# Altium project Serializer_Board.PrjPcb (part 2 of 2)

## Sheet FTDI_USB_To_UART.SchDoc
size A3; SheetNumber: 6; SheetTotal: 7
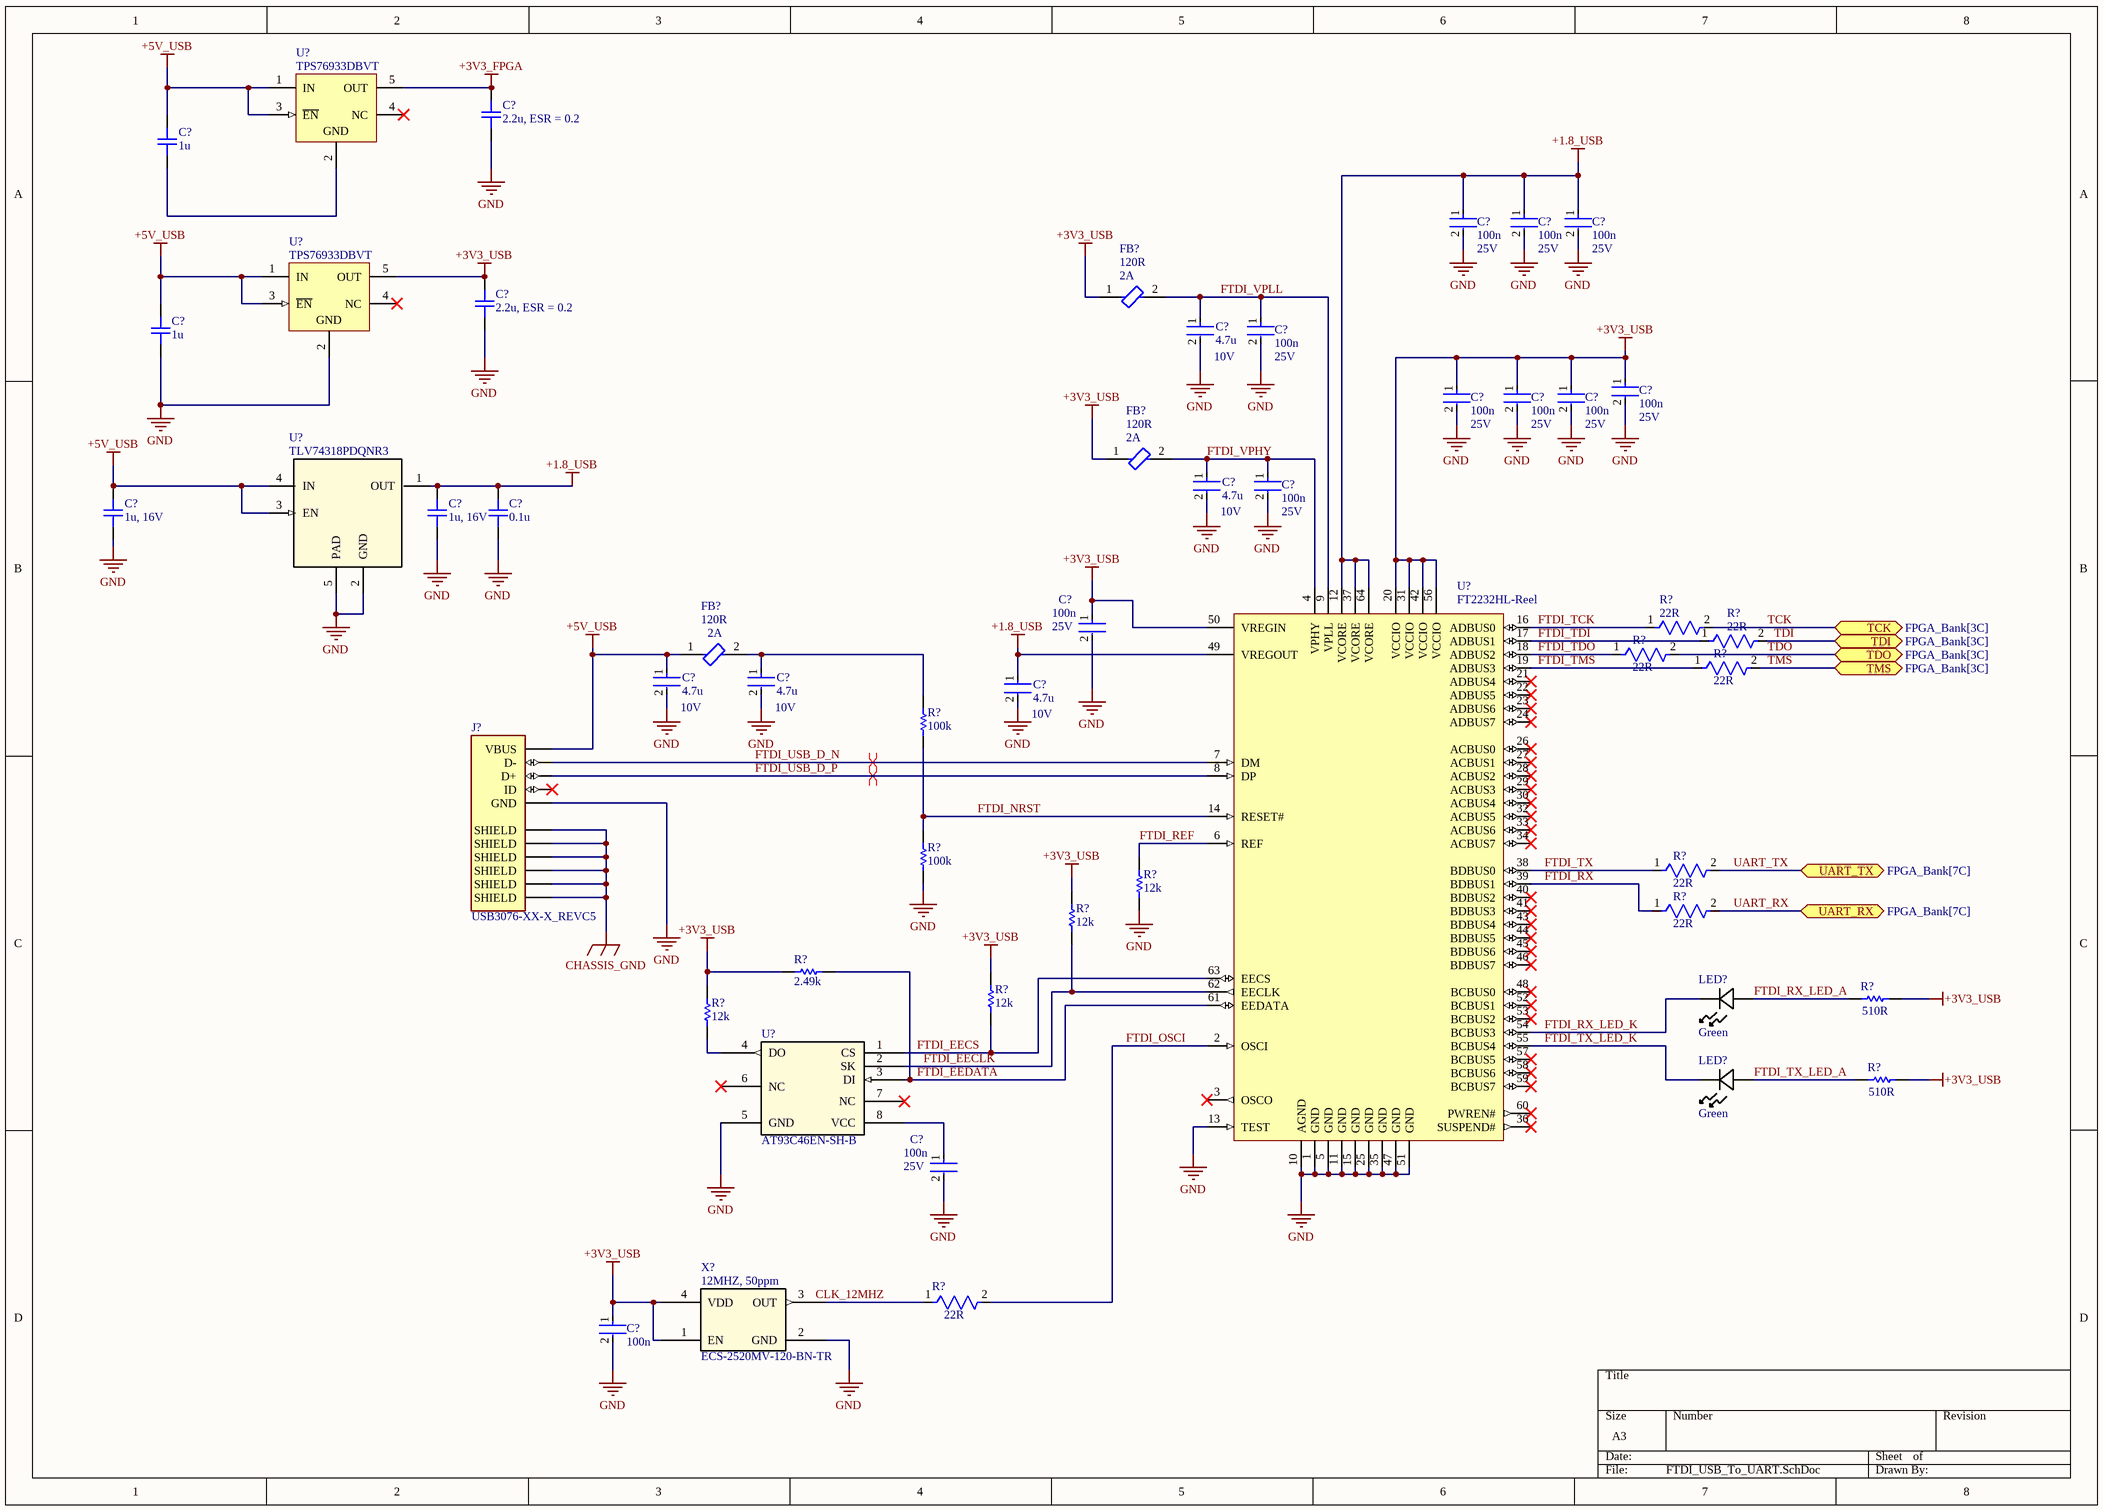
[diagram p3: FTDI_USB_To_UART.SchDoc]

### Parts
(Parts that share a designator on the sheet are numbered #1, #2 ... from top to bottom, then left to right.)
C?#42  2.2u, ESR = 0.2  [CAP_0603]
C?#43  1u  [CAP_0402]
C?#44  100n  [FP-CL278-IPC_C]
C?#45  100n  [FP-CL278-IPC_C]
C?#46  100n  [FP-CL278-IPC_C]
C?#47  2.2u, ESR = 0.2  [CAP_0603]
C?#48  4.7u  [FP-CL282-IPC_C]
C?#49  100n  [FP-CL278-IPC_C]
C?#50  1u  [CAP_0402]
C?#51  100n  [FP-CL278-IPC_C]
C?#52  100n  [FP-CL278-IPC_C]
C?#53  100n  [FP-CL278-IPC_C]
C?#54  100n  [FP-CL278-IPC_C]
C?#55  4.7u  [FP-CL282-IPC_C]
C?#56  100n  [FP-CL278-IPC_C]
C?#57  1u, 16V  [CAP_0402]
C?#58  1u, 16V  [CAP_0402]
C?#59  0.1u  [CAP_0402]
C?#60  100n  [FP-CL278-IPC_C]
C?#61  4.7u  [FP-CL282-IPC_C]
C?#62  4.7u  [FP-CL282-IPC_C]
C?#63  4.7u  [FP-CL282-IPC_C]
C?#64  100n  [FP-CL278-IPC_C]
C?#65  100n  [FP-CL278-IPC_C]
FB?#5  120R  [FP-BLM15-0_05-d0_7-MFG]
FB?#6  120R  [FP-BLM15-0_05-d0_7-MFG]
FB?#7  120R  [FP-BLM15-0_05-d0_7-MFG]
J?#3  USB3076-XX-X_REVC5  [GCT_USB3076-XX-X_REVC5]
LED?#1  Green  [LED_LTW-C193TS5_LTO]
LED?#2  Green  [LED_LTW-C193TS5_LTO]
R?#39  22R  [FP-RC0402-0_4-MFG]
R?#40  22R  [FP-RC0402-0_4-MFG]
R?#41  22R  [FP-RC0402-0_4-MFG]
R?#42  22R  [FP-RC0402-0_4-MFG]
R?#43  100k  [RESC1005X40X25NL05T10]
R?#44  100k  [RESC1005X40X25NL05T10]
R?#45  22R  [FP-RC0402-0_4-MFG]
R?#46  12k  [RESC1005X40X25NL05T10]
R?#47  22R  [FP-RC0402-0_4-MFG]
R?#48  12k  [RESC1005X40X25NL05T10]
R?#49  2.49k  [RESC1005X40X25NL05T10]
R?#50  510R  [RESC1005X40X25LL05T05]
R?#51  12k  [RESC1005X40X25NL05T10]
R?#52  12k  [RESC1005X40X25NL05T10]
R?#53  510R  [RESC1005X40X25LL05T05]
R?#54  22R  [FP-RC0402-0_4-MFG]
U?#3  TPS76933DBVT  [DBV0005A_N]
U?#4  TPS76933DBVT  [DBV0005A_N]
U?#5  TLV74318PDQNR3  [DQN0004A]
U?#6  FT2232HL-Reel  [LQFP-64_M]
U?#7  AT93C46EN-SH-B  [8S1_ATM]
X?  ECS-2520MV-120-BN-TR  [SMD4_ECS-2520MV_ECS]

### Ports
TCK (bidir, see FPGA_Bank[3C]), TDI (bidir, see FPGA_Bank[3C]), TDO (bidir, see FPGA_Bank[3C]), TMS (bidir, see FPGA_Bank[3C]), UART_RX (bidir, see FPGA_Bank[7C]), UART_TX (bidir, see FPGA_Bank[7C])

### Nets
+1.8_USB: C?#44.1 C?#45.1 C?#46.1 C?#58.2 C?#59.2 C?#63.1 U?#5.1(OUT) U?#6.12(VCORE) U?#6.37(VCORE) U?#6.49(VREGOUT) U?#6.64(VCORE)
+3V3_FPGA: C?#42.2 U?#3.5(OUT)
+3V3_USB: C?#47.2 C?#51.1 C?#52.1 C?#53.1 C?#54.1 C?#60.1 C?#65.1 FB?#5.1 FB?#6.1 R?#48.2 R?#49.1 R?#50.2 R?#51.2 R?#52.2 R?#53.2 U?#4.5(OUT) U?#6.20(VCCIO) U?#6.31(VCCIO) U?#6.42(VCCIO) U?#6.50(VREGIN) U?#6.56(VCCIO) X?.1(EN) X?.4(VDD)
+5V_USB: C?#43.2 C?#50.2 C?#57.2 C?#61.1 FB?#7.1 J?#3.1(VBUS) U?#3.1(IN) U?#3.3(~{EN}) U?#4.1(IN) U?#4.3(~{EN}) U?#5.3(EN) U?#5.4(IN)
CHASSIS_GND: J?#3.6(SHIELD) J?#3.7(SHIELD) J?#3.8(SHIELD) J?#3.9(SHIELD) J?#3.10(SHIELD) J?#3.11(SHIELD)
GND: C?#42.1 C?#44.2 C?#45.2 C?#46.2 C?#47.1 C?#48.2 C?#49.2 C?#50.1 C?#51.2 C?#52.2 C?#53.2 C?#54.2 C?#55.2 C?#56.2 C?#57.1 C?#58.1 C?#59.1 C?#60.2 C?#61.2 C?#62.2 C?#63.2 C?#64.2 C?#65.2 J?#3.5(GND) R?#44.1 R?#46.1 U?#4.2(GND) U?#5.2(GND) U?#5.5(PAD) U?#6.1(GND) U?#6.5(GND) U?#6.10(AGND) U?#6.11(GND) U?#6.13(TEST) U?#6.15(GND) U?#6.25(GND) U?#6.35(GND) U?#6.47(GND) U?#6.51(GND) U?#7.5(GND) X?.2(GND)
FTDI_EECLK: R?#48.1 U?#6.62(EECLK) U?#7.2(SK)  [project net FTDI_EECLK_6]
FTDI_EECS: R?#51.1 U?#6.63(EECS) U?#7.1(CS)  [project net FTDI_EECS_6]
FTDI_EEDATA: R?#49.2 U?#6.61(EEDATA) U?#7.3(DI)  [project net FTDI_EEDATA_6]
FTDI_NRST: R?#43.1 R?#44.2 U?#6.14(RESET#)  [project net FTDI_NRST_6]
FTDI_OSCI: R?#54.2 U?#6.2(OSCI)  [project net FTDI_OSCI_6]
FTDI_REF: R?#46.2 U?#6.6(REF)  [project net FTDI_REF_6]
FTDI_RX: R?#47.1 U?#6.39(BDBUS1)  [project net FTDI_RX_6]
FTDI_RX_LED_A: LED?#1.2 R?#50.1  [project net FTDI_RX_LED_A_6]
FTDI_RX_LED_K: LED?#1.1 U?#6.54(BCBUS3)  [project net FTDI_RX_LED_K_6]
FTDI_TCK: R?#39.1 U?#6.16(ADBUS0)  [project net FTDI_TCK_6]
FTDI_TDI: R?#40.1 U?#6.17(ADBUS1)  [project net FTDI_TDI_6]
FTDI_TDO: R?#41.1 U?#6.18(ADBUS2)  [project net FTDI_TDO_6]
FTDI_TMS: R?#42.1 U?#6.19(ADBUS3)  [project net FTDI_TMS_6]
FTDI_TX: R?#45.1 U?#6.38(BDBUS0)  [project net FTDI_TX_6]
FTDI_TX_LED_A: LED?#2.2 R?#53.1  [project net FTDI_TX_LED_A_6]
FTDI_TX_LED_K: LED?#2.1 U?#6.55(BCBUS4)  [project net FTDI_TX_LED_K_6]
FTDI_USB_D_N: J?#3.2(D-) U?#6.7(DM)  [project net FTDI_USB_D_N_6]
FTDI_USB_D_P: J?#3.3(D+) U?#6.8(DP)  [project net FTDI_USB_D_P_6]
FTDI_VPHY: C?#55.1 C?#56.1 FB?#6.2 U?#6.4(VPHY)  [project net FTDI_VPHY_6]
FTDI_VPLL: C?#48.1 C?#49.1 FB?#5.2 U?#6.9(VPLL)  [project net FTDI_VPLL_6]
TCK: R?#39.2 ; port TCK
TDI: R?#40.2 ; port TDI
TDO: R?#41.2 ; port TDO
TMS: R?#42.2 ; port TMS
UART_RX: R?#47.2 ; port UART_RX
UART_TX: R?#45.2 ; port UART_TX
NetC?#43_1: C?#43.1 U?#3.2(GND)
NetC?#62_1: C?#62.1 FB?#7.2 R?#43.2
NetC?#64_1: C?#64.1 U?#7.8(VCC)
NetR?#52_1: R?#52.1 U?#7.4(DO)
NetR?#54_1: R?#54.1 X?.3(OUT)

Not connected (* = marked no-connect by the designer): J?#3 4(ID)*; U?#3 4(NC)*; U?#4 4(NC)*; U?#6 3(OSCO)* 21(ADBUS4)* 22(ADBUS5)* 23(ADBUS6)* 24(ADBUS7)* 26(ACBUS0)* 27(ACBUS1)* 28(ACBUS2)* 29(ACBUS3)* 30(ACBUS4)* 32(ACBUS5)* 33(ACBUS6)* 34(ACBUS7)* 36(SUSPEND#)* 40(BDBUS2)* 41(BDBUS3)* 43(BDBUS4)* 44(BDBUS5)* 45(BDBUS6)* 46(BDBUS7)* 48(BCBUS0)* 52(BCBUS1)* 53(BCBUS2)* 57(BCBUS5)* 58(BCBUS6)* 59(BCBUS7)* 60(PWREN#)*; U?#7 6(NC)* 7(NC)*

### Layout directives
differential pair: FTDI_USB_D_N_6, FTDI_USB_D_P_6

### Notes on the sheet
- (near FB?#5) 2A
- (near C?#44) 25V
- (near C?#45) 25V
- (near C?#46) 25V
- (near C?#48) 10V
- (near C?#49) 25V
- (near FB?#6) 2A
- (near C?#52) 25V
- (near C?#53) 25V
- (near C?#54) 25V
- (near C?#51) 25V
- (near C?#55) 10V
- (near C?#56) 25V
- (near FB?#7) 2A
- (near C?#60) 25V
- (near C?#61) 10V
- (near C?#62) 10V
- (near C?#63) 10V
- (near C?#64) 25V
- (near X?) 12MHZ, 50ppm
- Labels drawn without touching a wire or pin: CLK_12MHZ

### Library data of the parts
C?#42 C?#47 = CAP_0603: Capacitor SMD 0603; Manufacturer: *; Manufacturer Part Number: *; Distributor Link: *; LCSC: *; Rating: *; Dielectric: *
C?#43 C?#50 C?#57-C?#59 = CAP_0402: Capacitor SMD 0402; Manufacturer: *; Manufacturer Part Number: *; Distributor Link: *; LCSC: *; Rating: *; Dielectric: *
C?#44-C?#46 C?#49 C?#51-C?#54 C?#56 C?#60 C?#64 C?#65 = CMP-13271-000728-1: Cap Ceramic 100nF 25V X5R ±10% SMD 0402 +85°C Paper T/R; Package Quantity: 1; Height: 0.5mm; Case Code (Metric): 1005; Thickness: 0.022inch; Mount: Surface Mount; Lead Free: Lead Free; Case Code (Imperial): 0402; Packaging: Tape and Reel; Depth: 0.5mm; Voltage: 25V; Min Operating Temperature: -55°C; Voltage Rating: 25V; Dielectric: X5R; Case/Package: 0402; Tolerance: 10%; Width: 0.02inch; Max Operating Temperature: 85°C; Capacitance: 100nF; Length: 1mm; Radiation Hardening: No; Voltage Rating (DC): 25V
C?#48 C?#55 C?#61-C?#63 = CMP-13271-000548-1: Cap Ceramic 4.7uF 10V X5R ±20% SMD 0402 +85°C Paper T/R; Capacitance: 4.7uF; Max Operating Temperature: 85°C; Lead Free: Lead Free; Tolerance: 20%; Voltage Rating: 10V; Dielectric: X5R; Width: 0.02inch; Length: 0.039inch; Case/Package: 0402; Min Operating Temperature: -55°C; Packaging: Tape and Reel; Thickness: 0.022inch; Case Code (Imperial): 0402; Package Quantity: 10000; Case Code (Metric): 1005; Mount: Surface Mount
FB?#5-FB?#7 = CMP-0686-00133-3: Chip Ferrite Bead, 0402, 120Ω @ 100MHz, 0.055Ω, 25%, 2A; DC Resistance (DCR): 55mR; Number of Circuits: 1; Material: Steel; Lead Free: Lead Free; Package Quantity: 10000; Impedance: 120R; Width: 0.5mm; Case Code (Metric): 1005; Test Frequency: 100MHz; Weight: 2.3E-05oz; Max DC Current: 2A; Current Rating: 2A; REACH SVHC: No SVHC; Case Code (Imperial): 0402; Min Operating Temperature: -55°C; Max Operating Temperature: 125°C; Max Current Rating: 2A; Series: EMIFIL®, BLM15P; Tolerance: 25%; Termination: SMD/SMT; Number of Lines: 1; Case/Package: 0402; RoHS Compliant: Yes; Number of Pins: 2; Length: 1mm; Height: 0.5mm; Packaging: Tape and Reel
J?#3 = USB3076-XX-X_REVC5: USB - micro B USB 2.0 Receptacle Connector 5 Position Surface Mount, Right Angle; Through Hole, 2.35mm profile, 5 Pins, Horizontal, Bottom mount; MP: USB3076-30-A; MF: Global Connector Technology; SnapEDA_Link: https://www.snapeda.com/parts/USB3076-30-A/Global+Connector+Technology/view-part/?ref=snap; Package: None; Check_prices: https://www.snapeda.com/parts/USB3076-30-A/Global+Connector+Technology/view-part/?ref=eda; Purchase-URL: https://pricing.snapeda.com/search/part/USB3076-30-A/?ref=eda; Price: None; Value: *; Availability: In Stock
LED?#1 LED?#2 = LTST-C191TGKT: No Description Available; Manufacturer_Name: LITE-ON; Copyright: Copyright (C) 2025 Ultra Librarian. All rights reserved.; Manufacturer_Part_Number: LTST-C191TGKT
R?#39-R?#42 R?#45 R?#47 R?#54 = CMP-2002-07520-2: Tolerance: 1%; Power Rating: 63mW; Voltage Rating: 50V; Temperature Coefficient: 100ppm/°C; Resistance: 22Ω; Termination: SMD/SMT; Depth: 500µm; Packaging: Tape & Reel; Height: 400µm; Width: 500µm; Case Code (Imperial): 0402; Length: 1mm; Schedule B: 8533210045, 8533210045; Case/Package: 0402; Max Operating Temperature: 155°C; Min Operating Temperature: -55°C; REACH SVHC: Unknown; RoHS: Compliant; Military Standard: Not; Voltage Rating (DC): 50V; Lead Free: Lead Free; Voltage Rating (AC): 50V; Number of Pins: 2; Composition: Thick Film
R?#43 R?#44 R?#46 R?#48 R?#51 R?#52 = CMP-2002-07343-1: Part Number: RC0402FR-07100KL; Manufacturer: Yageo / Phycomp
R?#49 = CMP-2002-07571-1: Part Number: RC0402FR-072K49L; Manufacturer: Yageo
R?#50 R?#53 = CMP-2002-00074-1: Part Number: CRCW0402510RFKED; Manufacturer: Vishay Dale
U?#3 U?#4 = CMP-0394-00641-2: Single Output LDO, 100 mA, Fixed 3.3 V Output, 2.7 to 10 V Input, with Low IQ, 5-pin SOT-23 (DBV), -40 to 125 degC, Green (RoHS & no Sb/Br); Manufacturer: Texas Instruments; Rating: Catalog; Accuracy(%): 3; Iout(Max)(A): 0.1; SubFamily: Single Channel LDO; Vout Adj(Min)(V): 3.3; Iq(Typ)(mA): 0.02; Vdo(Typ)(mV): 98; Vin(Max)(V): 10; Vin(Min)(V): 2.7; ComponentLink4Description: URL Link1; PackageReference: DBV0005A; ComponentLink2URL: http://www.ti.com/general/docs/lit/getliterature.tsp?genericPartNumber=TPS76933&fileType=pdf; PartNumber: TPS76933DBVT; ComponentLink4URL: Samples URL:http://www.ti.com/product/tps76933#samples; ComponentLink2Description: Datasheet; ComponentLink3Description: Package Specification; Fixed Output Options(V): 3.3; PackageDescription: 5-Pin Plastic Small Outline, Body 1.60 Ãƒâ€” 2.90 mm, Pitch 0.95 mm; Vout Adj(Max)(V): 3.3; ComponentLink1Description: Manufacturer URL; Code_JEDEC: MO-178; DatasheetVersion: SLVS203E; PackageVersion: 4073253-4/K; ComponentLink1URL: http://www.ti.com/; ComponentLink3URL: http://www.ti.com/litv/pdf/mpds018i; Eco-Plan: Green (RoHS & no Sb/Br); Mounting Technology: Surface Mount
U?#5 = TLV74318PDQNR3: 300mA low-Iq low-dropout (LDO) voltage regulator with enable 4-X2SON -40 to 125; Manufacturer_Name: Texas Instruments; TYPE: TYPE; RefDes: RefDes; Copyright: Copyright (C) 2025 Ultra Librarian. All rights reserved.; Manufacturer_Part_Number: TLV74318PDQNR3; Datasheet: https://www.ti.com/lit/gpn/tlv743p
U?#6 = CMP-0078-00023-3: Dual High Speed USB To Multipurpose UART/FIFO IC, 64-pin LQFP, Tape and Reel; Manufacturer: FTDI; DatasheetVersion: ver 2.21, Jun-2012; ComponentLink1URL: http://www.ftdichip.com/; PartNumber: FT2232HL-Reel; ComponentLink2Description: Datasheet; RevisionNote: DatasheetVersion updated to 2.21 Jun-2012; PackageVersion: Jun-12; ComponentLink1Description: Manufacturer URL; ComponentLink2URL: http://www.ftdichip.com/Support/Documents/DataSheets/ICs/DS_FT2232H.pdf; PackageReference: LQFP-64; PackageDescription: 64-Pin Thin Quad Flat Pack, 10 x 10 x 1.4 mm Body, 0.5 mm Pitch
U?#7 = AT93C46EN-SH-B: No Description Available; Manufacturer_Name: Microchip; Copyright: Copyright (C) 2025 Ultra Librarian. All rights reserved.; Manufacturer_Part_Number: AT93C46EN-SH-B; RefDes: RefDes; Type: Type
X? = ECS-2520MV-120-BN-TR: Description; Manufacturer_Name: ECS International; Copyright: Copyright (C) 2025 Ultra Librarian. All rights reserved.; Manufacturer_Part_Number: ECS-2520MV-120-BN-TR; RefDes: RefDes; Type: Type

## Sheet FPGA_Bank.SchDoc
size A2; SheetNumber: 7; SheetTotal: 7
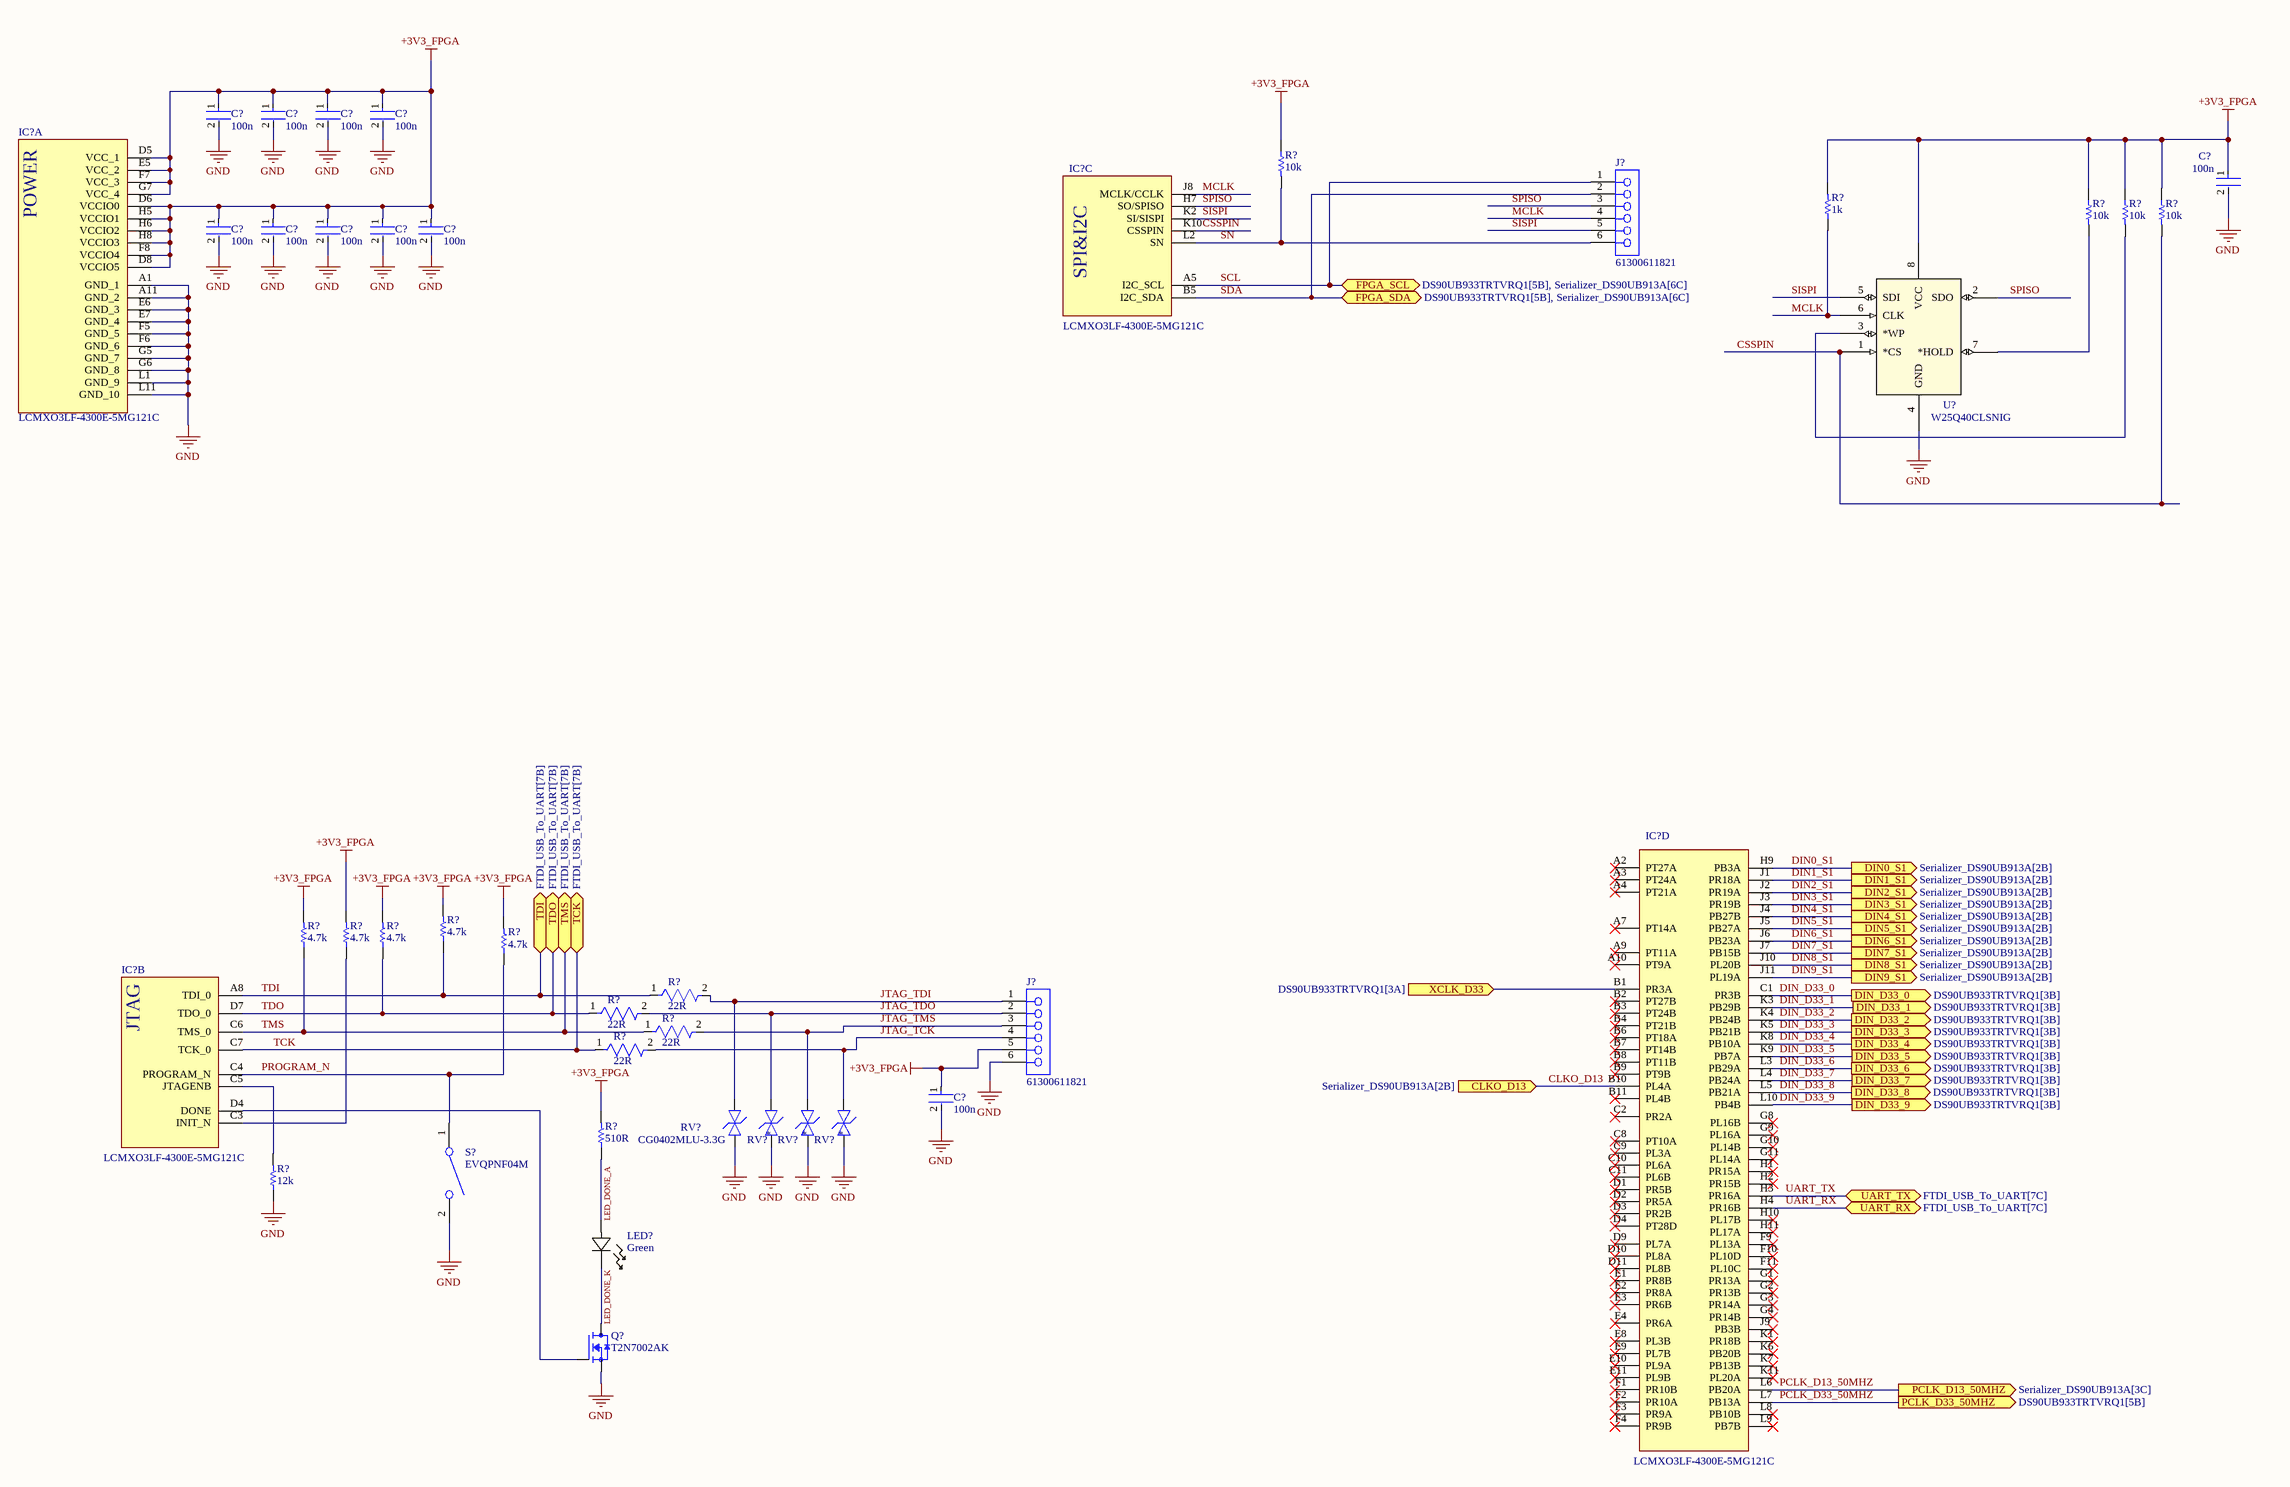
[diagram p4: FPGA_Bank.SchDoc]

### Parts
(Parts that share a designator on the sheet are numbered #1, #2 ... from top to bottom, then left to right.)
C?#66  100n  [FP-CL278-IPC_C]
C?#67  100n  [FP-CL278-IPC_C]
C?#68  100n  [FP-CL278-IPC_C]
C?#69  100n  [FP-CL278-IPC_C]
C?#70  100n  [FP-CL278-IPC_C]
C?#71  100n  [FP-CL278-IPC_C]
C?#72  100n  [FP-CL278-IPC_C]
C?#73  100n  [FP-CL278-IPC_C]
C?#74  100n  [FP-CL278-IPC_C]
C?#75  100n  [FP-CL278-IPC_C]
C?#76  100n  [FP-CL278-IPC_C]
IC?#2  LCMXO3LF-4300E-5MG121C  [CSFBGA-121_L6.0-W6.0-R11-C11-P0.50-TL]  (part A of 4)
IC?#3  LCMXO3LF-4300E-5MG121C  [CSFBGA-121_L6.0-W6.0-R11-C11-P0.50-TL]  (part C of 4)
IC?#4  LCMXO3LF-4300E-5MG121C  [CSFBGA-121_L6.0-W6.0-R11-C11-P0.50-TL]  (part B of 4)
IC?#5  LCMXO3LF-4300E-5MG121C  [CSFBGA-121_L6.0-W6.0-R11-C11-P0.50-TL]  (part D of 4)
J?#4  61300611821  [61300611821]
J?#5  61300611821  [61300611821]
LED?#3  Green  [LED_LTW-C193TS5_LTO]
Q?  T2N7002AK  [SOT-23_TOS]
R?#55  10k  [RESC1005X40X25ML05T10]
R?#56  10k  [RESC1005X40X25ML05T10]
R?#57  10k  [RESC1005X40X25ML05T10]
R?#58  10k  [RESC1005X40X25ML05T10]
R?#59  1k  [RESC1005X40X25NL05T05]
R?#60  4.7k  [RESC1005X40X25LL05T05]
R?#61  4.7k  [RESC1005X40X25LL05T05]
R?#62  4.7k  [RESC1005X40X25LL05T05]
R?#63  4.7k  [RESC1005X40X25LL05T05]
R?#64  4.7k  [RESC1005X40X25LL05T05]
R?#65  22R  [FP-RC0402-0_4-MFG]
R?#66  22R  [FP-RC0402-0_4-MFG]
R?#67  22R  [FP-RC0402-0_4-MFG]
R?#68  22R  [FP-RC0402-0_4-MFG]
R?#69  510R  [RESC1005X40X25LL05T05]
R?#70  12k  [RESC1005X40X25NL05T10]
RV?#1  CG0402MLU-3.3G  [VARC1005X41N]
RV?#2  *  [VARC1005X41N]
RV?#3  *  [VARC1005X41N]
RV?#4  *  [VARC1005X41N]
S?#5  EVQPNF04M  [EVQ5PN05K]
U?#8  W25Q40CLSNIG  [WIN_SN-8_WIN]

### Ports
CLKO_D13 (in, see Serializer_DS90UB913A[2B]), DIN0_S1 (out, see Serializer_DS90UB913A[2B]), DIN1_S1 (out, see Serializer_DS90UB913A[2B]), DIN2_S1 (out, see Serializer_DS90UB913A[2B]), DIN3_S1 (out, see Serializer_DS90UB913A[2B]), DIN4_S1 (out, see Serializer_DS90UB913A[2B]), DIN5_S1 (out, see Serializer_DS90UB913A[2B]), DIN6_S1 (out, see Serializer_DS90UB913A[2B]), DIN7_S1 (out, see Serializer_DS90UB913A[2B]), DIN8_S1 (out, see Serializer_DS90UB913A[2B]), DIN9_S1 (out, see Serializer_DS90UB913A[2B]), DIN_D33_0 (out, see DS90UB933TRTVRQ1[3B]), DIN_D33_1 (out, see DS90UB933TRTVRQ1[3B]), DIN_D33_2 (out, see DS90UB933TRTVRQ1[3B]), DIN_D33_3 (out, see DS90UB933TRTVRQ1[3B]), DIN_D33_4 (out, see DS90UB933TRTVRQ1[3B]), DIN_D33_5 (out, see DS90UB933TRTVRQ1[3B]), DIN_D33_6 (out, see DS90UB933TRTVRQ1[3B]), DIN_D33_7 (out, see DS90UB933TRTVRQ1[3B]), DIN_D33_8 (out, see DS90UB933TRTVRQ1[3B]), DIN_D33_9 (out, see DS90UB933TRTVRQ1[3B]), FPGA_SCL (bidir, see DS90UB933TRTVRQ1[5B], Serializer_DS90UB913A[6C]), FPGA_SDA (bidir, see DS90UB933TRTVRQ1[5B], Serializer_DS90UB913A[6C]), PCLK_D13_50MHZ (out, see Serializer_DS90UB913A[3C]), PCLK_D33_50MHZ (out, see DS90UB933TRTVRQ1[5B]), TCK (bidir, see FTDI_USB_To_UART[7B]), TDI (bidir, see FTDI_USB_To_UART[7B]), TDO (bidir, see FTDI_USB_To_UART[7B]), TMS (bidir, see FTDI_USB_To_UART[7B]), UART_RX (bidir, see FTDI_USB_To_UART[7C]), UART_TX (bidir, see FTDI_USB_To_UART[7C]), XCLK_D33 (in, see DS90UB933TRTVRQ1[3A])

### Nets
+3V3_FPGA: C?#66.1 C?#67.1 C?#68.1 C?#69.1 C?#70.1 C?#71.1 C?#72.1 C?#73.1 C?#74.1 C?#75.1 C?#76.1 IC?#2.D5(VCC_1) IC?#2.D6(VCCIO0) IC?#2.D8(VCCIO5) IC?#2.E5(VCC_2) IC?#2.F7(VCC_3) IC?#2.F8(VCCIO4) IC?#2.G7(VCC_4) IC?#2.H5(VCCIO1) IC?#2.H6(VCCIO2) IC?#2.H8(VCCIO3) J?#5.5 R?#55.1 R?#56.1 R?#57.1 R?#58.1 R?#59.2 R?#60.2 R?#61.2 R?#62.2 R?#63.2 R?#64.2 R?#69.2 U?#8.8(VCC)
GND: C?#66.2 C?#67.2 C?#68.2 C?#69.2 C?#70.2 C?#71.2 C?#72.2 C?#73.2 C?#74.2 C?#75.2 C?#76.2 IC?#2.A1(GND_1) IC?#2.A11(GND_2) IC?#2.E6(GND_3) IC?#2.E7(GND_4) IC?#2.F5(GND_5) IC?#2.F6(GND_6) IC?#2.G5(GND_7) IC?#2.G6(GND_8) IC?#2.L1(GND_9) IC?#2.L11(GND_10) J?#5.6 Q?.2(S) R?#70.1 RV?#1.A RV?#2.A RV?#3.A RV?#4.A S?#5.2(NO) U?#8.4(GND)
CLKO_D13: IC?#5.B10(PL4A) ; port CLKO_D13
CSSPIN: IC?#3.K10(CSSPIN) R?#58.2 U?#8.1(*CS)  [project net CSSPIN_7]
DIN0_S1: IC?#5.H9(PB3A) ; port DIN0_S1
DIN1_S1: IC?#5.J1(PR18A) ; port DIN1_S1
DIN2_S1: IC?#5.J2(PR19A) ; port DIN2_S1
DIN3_S1: IC?#5.J3(PR19B) ; port DIN3_S1
DIN4_S1: IC?#5.J4(PB27B) ; port DIN4_S1
DIN5_S1: IC?#5.J5(PB27A) ; port DIN5_S1
DIN6_S1: IC?#5.J6(PB23A) ; port DIN6_S1
DIN7_S1: IC?#5.J7(PB15B) ; port DIN7_S1
DIN8_S1: IC?#5.J10(PL20B) ; port DIN8_S1
DIN9_S1: IC?#5.J11(PL19A) ; port DIN9_S1
DIN_D33_0: IC?#5.C1(PR3B) ; port DIN_D33_0
DIN_D33_1: IC?#5.K3(PB29B) ; port DIN_D33_1
DIN_D33_2: IC?#5.K4(PB24B) ; port DIN_D33_2
DIN_D33_3: IC?#5.K5(PB21B) ; port DIN_D33_3
DIN_D33_4: IC?#5.K8(PB10A) ; port DIN_D33_4
DIN_D33_5: IC?#5.K9(PB7A) ; port DIN_D33_5
DIN_D33_6: IC?#5.L3(PB29A) ; port DIN_D33_6
DIN_D33_7: IC?#5.L4(PB24A) ; port DIN_D33_7
DIN_D33_8: IC?#5.L5(PB21A) ; port DIN_D33_8
DIN_D33_9: IC?#5.L10(PB4B) ; port DIN_D33_9
JTAG_TCK: J?#5.4 R?#68.2 RV?#4.K  [project net JTAG_TCK_7]
JTAG_TDI: J?#5.1 R?#65.2 RV?#1.K  [project net JTAG_TDI_7]
JTAG_TDO: J?#5.2 R?#66.2 RV?#2.K  [project net JTAG_TDO_7]
JTAG_TMS: J?#5.3 R?#67.2 RV?#3.K  [project net JTAG_TMS_7]
LED_DONE_A: LED?#3.2 R?#69.1  [project net LED_DONE_A_7]
LED_DONE_K: LED?#3.1 Q?.3(D)  [project net LED_DONE_K_7]
MCLK: IC?#3.J8(MCLK/CCLK) J?#4.4 R?#59.1 U?#8.6(CLK)  [project net MCLK_7]
PCLK_D13_50MHZ: IC?#5.L6(PB20A) ; port PCLK_D13_50MHZ
PCLK_D33_50MHZ: IC?#5.L7(PB13A) ; port PCLK_D33_50MHZ
PROGRAM_N: IC?#4.C4(PROGRAM_N) R?#64.1 S?#5.1(COM)  [project net PROGRAM_N_7]
SCL: IC?#3.A5(I2C_SCL) J?#4.1 ; port FPGA_SCL
SDA: IC?#3.B5(I2C_SDA) J?#4.2 ; port FPGA_SDA
SISPI: IC?#3.K2(SI/SISPI) J?#4.5 U?#8.5(SDI)  [project net SISPI_7]
SN: IC?#3.L2(SN) J?#4.6 R?#55.2  [project net SN_7]
SPISO: IC?#3.H7(SO/SPISO) J?#4.3 U?#8.2(SDO)  [project net SPISO_7]
TCK: IC?#4.C7(TCK_0) R?#68.1 ; port TCK
TDI: IC?#4.A8(TDI_0) R?#60.1 R?#65.1 ; port TDI
TDO: IC?#4.D7(TDO_0) R?#63.1 R?#66.1 ; port TDO
TMS: IC?#4.C6(TMS_0) R?#61.1 R?#67.1 ; port TMS
UART_RX: IC?#5.H4(PR16B) ; port UART_RX
UART_TX: IC?#5.H3(PR16A) ; port UART_TX
NetIC?#4_C3: IC?#4.C3(INIT_N) R?#62.1
NetIC?#4_C5: IC?#4.C5(JTAGENB) R?#70.2
NetIC?#4_D4: IC?#4.D4(DONE) Q?.1(G)
NetIC?#5_B1: IC?#5.B1(PR3A) ; port XCLK_D33
NetR?#56_2: R?#56.2 U?#8.7(*HOLD)
NetR?#57_2: R?#57.2 U?#8.3(*WP)

Not connected (* = marked no-connect by the designer): IC?#5 A2(PT27A)* A3(PT24A)* A4(PT21A)* A7(PT14A)* A9(PT11A)* A10(PT9A)* B2(PT27B)* B3(PT24B)* B4(PT21B)* B6(PT18A)* B7(PT14B)* B8(PT11B)* B9(PT9B)* B11(PL4B)* C2(PR2A)* C8(PT10A)* C9(PL3A)* C10(PL6A)* C11(PL6B)* D1(PR5B)* D2(PR5A)* D3(PR2B)* D4(PT28D)* D9(PL7A)* D10(PL8A)* D11(PL8B)* E1(PR8B)* E2(PR8A)* E3(PR6B)* E4(PR6A)* E8(PL3B)* E9(PL7B)* E10(PL9A)* E11(PL9B)* F1(PR10B)* F2(PR10A)* F3(PR9A)* F4(PR9B)* F9(PL13A)* F10(PL10D)* F11(PL10C)* G1(PR13A)* G2(PR13B)* G3(PR14A)* G4(PR14B)* G8(PL16B)* G9(PL16A)* G10(PL14B)* G11(PL14A)* H1(PR15A)* H2(PR15B)* H10(PL17B)* H11(PL17A)* J9(PB3B)* K1(PR18B)* K6(PB20B)* K7(PB13B)* K11(PL20A)* L8(PB10B)* L9(PB7B)*

### Notes on the sheet
- (in symbol LCMXO3LF-4300E-5MG121C, part A) POWER
- (in symbol LCMXO3LF-4300E-5MG121C, part B) JTAG
- (in symbol LCMXO3LF-4300E-5MG121C, part C) SPI&I2C

### Library data of the parts
C?#66-C?#76 = CMP-13271-000728-1: as C?#44 on sheet FTDI_USB_To_UART; Package Quantity: 1; Height: 0.5mm; Case Code (Metric): 1005; Thickness: 0.022inch; Mount: Surface Mount; Lead Free: Lead Free; Case Code (Imperial): 0402; Packaging: Tape and Reel; Depth: 0.5mm; Voltage: 25V; Min Operating Temperature: -55°C; Voltage Rating: 25V; Dielectric: X5R; Case/Package: 0402; Tolerance: 10%; Width: 0.02inch; Max Operating Temperature: 85°C; Capacitance: 100nF; Length: 1mm; Radiation Hardening: No; Voltage Rating (DC): 25V
IC?#2-IC?#5 = LCMXO3LF-4300E-5MG121C: FPGA IC; Manufacturer_Name: Lattice Semiconductor; Datasheet Link: https://www.latticesemi.com/MachXO3; Height: 1mm; Manufacturer_Part_Number: LCMXO3LF-4300E-5MG121C; Mouser Part Number: 842-O3LF4300E5MG121C; Mouser Price/Stock: https://www.mouser.co.uk/ProductDetail/Lattice/LCMXO3LF-4300E-5MG121C?qs=Zwj7mHVHPHTjqjc5ga7IUA%3D%3D; Arrow Part Number: LCMXO3LF-4300E-5MG121C; Arrow Price/Stock: https://www.arrow.com/en/products/lcmxo3lf-4300e-5mg121c/lattice-semiconductor?region=nac
J?#4 J?#5 = CMP-1502-01322-4: THT Vertical Socket Header WR-PHD, Pitch 2.54 mm, Single Row, 6 pins; Current Rating: 3A; Contact Resistance: 20mΩ; Gender: Female; Operating Supply Voltage: 250V; RoHS: Compliant; Orientation: Vertical; Number of Pins: 6; Lead Pitch: 2.54mm
LED?#3 = LTST-C191TGKT: as LED?#1 on sheet FTDI_USB_To_UART; Copyright: Copyright (C) 2025 Ultra Librarian. All rights reserved.; Manufacturer_Part_Number: LTST-C191TGKT
Q? = T2N7002AK: N-ch MOSFET, 60 V, 0.2 A, 3.9 Î©@10V, SOT-23(SOT23); Manufacturer_Name: Toshiba Electronic Devices & Storage Corp.; Copyright: Copyright (C) 2025 Ultra Librarian. All rights reserved.; Manufacturer_Part_Number: T2N7002AK; RefDes: RefDes; Type: Type
R?#55-R?#58 = CMP-2002-03043-1: Part Number: CRCW040210K0FKEDHP; Manufacturer: Vishay Dale
R?#59 = CMP-1011-00510-4: Chip Resistor, 1 KOhm, +/- 1%, 100 mW, -55 to 155 degC, 0402 (1005 Metric), RoHS, Tape and Reel; PartNumber: ERJ-2RKF1001X; Manufacturer: Basic Passives; Voltage Rating: 50 V; Case\/Package: 0402; Resistance: 1 KOhm; Power Rating: 100 mW; DatasheetVersion: 04/2015; Radiation Hardening: No; Pins: 2; Height: 0.35 mm; RoHSCompliant: true; Case Code (Imperial): 0402; ComponentLink2Description: Datasheet; ComponentLink1Description: Manufacturer URL; PackageReference: 0402; Mount: Surface Mount; Package Quantity: 10000; Tolerance: 1%; ComponentLink1URL: http://www.panasonic.com/; PackageDescription: 2-Pin Surface Mount Device, Body 1 x 0.5 mm; Mounting Technology: Surface Mount; Case Code (Metric): 1005; ComponentLink2URL: http://industrial.panasonic.com/cdbs/www-data/pdf/RDA0000/AOA0000C86.pdf; REACH SVHC: Yes; Packaging: Tape and Reel; Max Operating Temperature: 155 degC; Min Operating Temperature: -55 degC; Width: 0.5 mm; Length: 1 mm
R?#60-R?#64 = CMP-2002-01154-4: Chip Resistor, 4.7 KOhm, +/- 1%, 0.1 W, -55 to 155 degC, 0402 (1005 Metric), RoHS, Tape and Reel; PartNumber: ERJ-2RKF4701X; Voltage Rating: 50 V; Case\/Package: 0402; Power Rating: 100 mW; Height: 0.35 mm; Mounting Technology: Surface Mount; REACH SVHC: Yes; Resistance: 4.7 KOhm; Max Operating Temperature: 155 degC; ComponentLink1Description: Manufacturer URL; ComponentLink2Description: Datasheet; Pins: 2; PackageReference: 0402; Tolerance: 1%; Case Code (Imperial): 0402; Length: 1 mm; PackageDescription: 2-Pin Surface Mount Device, Body 1 x 0.5 mm; RoHSCompliant: true; Package Quantity: 1; Radiation Hardening: No; DatasheetVersion: 04/2015; Width: 0.5 mm; Case Code (Metric): 1005; Mount: Surface Mount; ComponentLink1URL: http://www.panasonic.com/; Min Operating Temperature: -55 degC; Packaging: Cut Tape; ComponentLink2URL: http://industrial.panasonic.com/cdbs/www-data/pdf/RDA0000/AOA0000C86.pdf
R?#65-R?#68 = CMP-2002-07520-2: as R?#39 on sheet FTDI_USB_To_UART; Termination: SMD/SMT; Depth: 500µm; Packaging: Tape & Reel; Height: 400µm; Width: 500µm; Case Code (Imperial): 0402; Length: 1mm; Schedule B: 8533210045, 8533210045; Case/Package: 0402; Max Operating Temperature: 155°C; Min Operating Temperature: -55°C; REACH SVHC: Unknown; RoHS: Compliant; Military Standard: Not; Voltage Rating (DC): 50V; Lead Free: Lead Free; Voltage Rating (AC): 50V; Number of Pins: 2; Composition: Thick Film
R?#69 = CMP-2002-00074-1: as R?#50 on sheet FTDI_USB_To_UART
R?#70 = CMP-2002-07343-1: as R?#43 on sheet FTDI_USB_To_UART
RV?#1-RV?#4 = CG0402MLU-3.3G: Varistor; Manufacturer_Name: Bourns; Datasheet Link: https://www.bourns.com/docs/Product-Datasheets/MLU.pdf; Height: 0.41mm; Manufacturer_Part_Number: CG0402MLU-3.3G; Mouser Part Number: 652-CG0402MLU-3.3G; Mouser Price/Stock: https://www.mouser.co.uk/ProductDetail/Bourns/CG0402MLU-3.3G?qs=m8myXnDJXpWVM8EQWErxtQ%3D%3D; Arrow Part Number: CG0402MLU-3.3G; Arrow Price/Stock: https://www.arrow.com/en/products/cg0402mlu-3.3g/bourns?utm_currency=USD&region=nac
S?#5 = EVQPNF04M: Switch; Manufacturer_Name: Panasonic; Datasheet Link: https://industrial.panasonic.com/cdbs/www-data/pdf/ATK0000/ATK0000C376.pdf; Manufacturer_Part_Number: EVQPNF04M
U?#8 = W25Q40CLSNIG: No Description Available; Manufacturer_Name: Winbond; Copyright: Copyright (C) 2026 Ultra Librarian. All rights reserved.; Manufacturer_Part_Number: W25Q40CLSNIG; RefDes: RefDes; Type: Type

## Nets that join several sheets
+3V3_FPGA: FTDI_USB_To_UART (C?#42.2 U?#3.5), FPGA_Bank (34 pins)
+VDD5V: Serializer_DS90UB913A (C?#16.2 C?#17.1 FB?#1.2), BuckRegulatorOnSer (R41.2)
GND: Serializer_DS90UB913A (45 pins), BuckRegulatorOnSer (24 pins), DS90UB933TRTVRQ1 (24 pins), FTDI_USB_To_UART (41 pins), FPGA_Bank (30 pins)
VDD3P3_A: Serializer_DS90UB913A (R?#17.2 R?#18.2), BuckRegulatorOnSer (JP13.2)
CLKO_D13: Serializer_DS90UB913A (R?#11.1 U?#1.17), FPGA_Bank (IC?#5.B10)
DIN0_S1: Serializer_DS90UB913A (R?#1.1 U?#1.19), FPGA_Bank (IC?#5.H9)
DIN1_S1: Serializer_DS90UB913A (R?#2.1 U?#1.20), FPGA_Bank (IC?#5.J1)
DIN2_S1: Serializer_DS90UB913A (R?#3.1 U?#1.21), FPGA_Bank (IC?#5.J2)
DIN3_S1: Serializer_DS90UB913A (R?#4.1 U?#1.22), FPGA_Bank (IC?#5.J3)
DIN4_S1: Serializer_DS90UB913A (R?#5.1 U?#1.23), FPGA_Bank (IC?#5.J4)
DIN5_S1: Serializer_DS90UB913A (R?#6.1 U?#1.24), FPGA_Bank (IC?#5.J5)
DIN6_S1: Serializer_DS90UB913A (R?#7.1 U?#1.26), FPGA_Bank (IC?#5.J6)
DIN7_S1: Serializer_DS90UB913A (R?#8.1 U?#1.27), FPGA_Bank (IC?#5.J7)
DIN8_S1: Serializer_DS90UB913A (R?#9.1 U?#1.29), FPGA_Bank (IC?#5.J10)
DIN9_S1: Serializer_DS90UB913A (R?#10.1 U?#1.30), FPGA_Bank (IC?#5.J11)
DIN_D33_0: DS90UB933TRTVRQ1 (U?#2.19), FPGA_Bank (IC?#5.C1)
DIN_D33_1: DS90UB933TRTVRQ1 (U?#2.20), FPGA_Bank (IC?#5.K3)
DIN_D33_2: DS90UB933TRTVRQ1 (U?#2.21), FPGA_Bank (IC?#5.K4)
DIN_D33_3: DS90UB933TRTVRQ1 (U?#2.22), FPGA_Bank (IC?#5.K5)
DIN_D33_4: DS90UB933TRTVRQ1 (U?#2.23), FPGA_Bank (IC?#5.K8)
DIN_D33_5: DS90UB933TRTVRQ1 (U?#2.24), FPGA_Bank (IC?#5.K9)
DIN_D33_6: DS90UB933TRTVRQ1 (U?#2.26), FPGA_Bank (IC?#5.L3)
DIN_D33_7: DS90UB933TRTVRQ1 (U?#2.27), FPGA_Bank (IC?#5.L4)
DIN_D33_8: DS90UB933TRTVRQ1 (U?#2.29), FPGA_Bank (IC?#5.L5)
DIN_D33_9: DS90UB933TRTVRQ1 (U?#2.30), FPGA_Bank (IC?#5.L10)
NetIC?#5_B1: DS90UB933TRTVRQ1 (R?#30.1), FPGA_Bank (IC?#5.B1)
PCLK_D13_50MHZ: Serializer_DS90UB913A (U?#1.3), FPGA_Bank (IC?#5.L6)
PCLK_D33_50MHZ: DS90UB933TRTVRQ1 (U?#2.3), FPGA_Bank (IC?#5.L7)
SCL: Serializer_DS90UB913A (R?#23.1), DS90UB933TRTVRQ1 (R?#36.1 U?#2.4), FPGA_Bank (IC?#3.A5 J?#4.1)
SDA: Serializer_DS90UB913A (R?#24.1), DS90UB933TRTVRQ1 (R?#35.1 U?#2.5), FPGA_Bank (IC?#3.B5 J?#4.2)
TCK: FTDI_USB_To_UART (R?#39.2), FPGA_Bank (IC?#4.C7 R?#68.1)
TDI: FTDI_USB_To_UART (R?#40.2), FPGA_Bank (IC?#4.A8 R?#60.1 R?#65.1)
TDO: FTDI_USB_To_UART (R?#41.2), FPGA_Bank (IC?#4.D7 R?#63.1 R?#66.1)
TMS: FTDI_USB_To_UART (R?#42.2), FPGA_Bank (IC?#4.C6 R?#61.1 R?#67.1)
UART_RX: FTDI_USB_To_UART (R?#47.2), FPGA_Bank (IC?#5.H4)
UART_TX: FTDI_USB_To_UART (R?#45.2), FPGA_Bank (IC?#5.H3)